# EAGLE design EarBones (EAGLE 7.6.0)
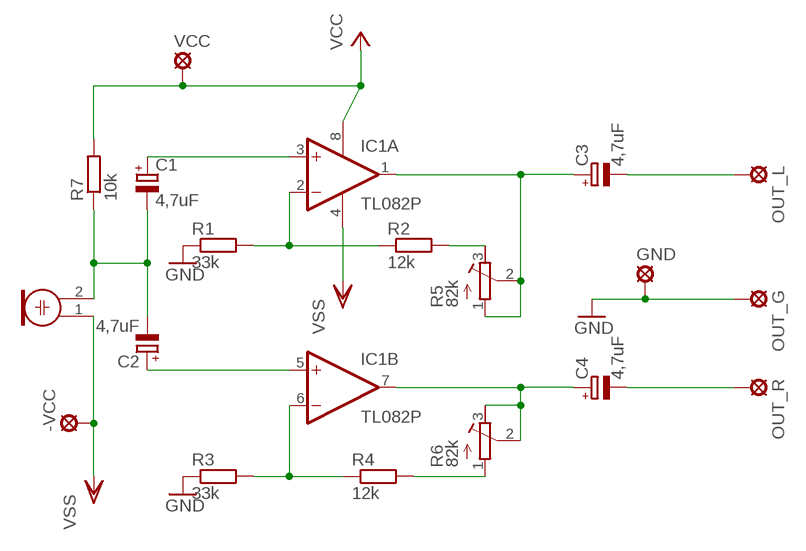
[diagram p0: schematic, sheet 1]

## Parts
-VCC  LSP10  [LSP10]
C1  4,7uF  CPOL-EUE2,5-6E  [E2,5-6E]
C2  4,7uF  CPOL-EUE2,5-6E  [E2,5-6E]
C3  4,7uF  CPOL-EUE2,5-6E  [E2,5-6E]
C4  4,7uF  CPOL-EUE2,5-6E  [E2,5-6E]
GND  LSP10  [LSP10]
IC1  TL082P  [DIL08]
M1  ELECTRET_MICROPHON-WM-61B  [WM-61B]
OUT_G  LSP10  [LSP10]
OUT_L  LSP10  [LSP10]
OUT_R  LSP10  [LSP10]
R1  33k  R-EU_0207/10  [0207/10]
R2  12k  R-EU_0207/10  [0207/10]
R3  33k  R-EU_0207/10  [0207/10]
R4  12k  R-EU_0207/10  [0207/10]
R5  82k  R-TRIMM3339P  [RTRIM3339P]
R6  82k  R-TRIMM3339P  [RTRIM3339P]
R7  10k  R-EU_0207/10  [0207/10]
VCC  LSP10  [LSP10]

## Nets
GND: GND.MP OUT_G.MP R1.1 R3.1
N$1: IC1.6(B:-IN) R3.2 R4.1
N$2: R4.2 R6.1(A)
N$3: C4.+ IC1.7(B:OUT) R6.2(S) R6.3(E)
N$4: C3.+ IC1.1(A:OUT) R5.1(A) R5.2(S)
N$5: R2.2 R5.3(E)
N$6: IC1.2(A:-IN) R1.2 R2.1
N$7: C1.+ IC1.3(A:+IN)
N$8: C2.+ IC1.5(B:+IN)
N$10: C1.- C2.- M1.2 R7.1
N$13: C4.- OUT_R.MP
N$14: C3.- OUT_L.MP
VCC: IC1.8(P:V+) R7.2 VCC.MP
VSS: -VCC.MP IC1.4(P:V-) M1.1

## Library data of the parts
-VCC GND OUT_G OUT_L OUT_R VCC = solpad:LSP10: SOLDER PAD drill 1.0 mm, distributor Buerklin, 12H555
C1-C4 = rcl:CPOL-EU: POLARIZED CAPACITOR, European symbol
IC1 = linear:TL082: OP AMP Data sheet <http://www.ti.com/lit/ds/symlink/tl084a . pdf>; DATA_SHEET: <a href="http://www.ti.com/lit/ds/symlink/tl084a.pdf"> Data sheet </a>
M1 = microphon:ELECTRET_MICROPHON-: Electret Condenser Microphone
R1-R4 R7 = rcl:R-EU_: RESISTOR, European symbol
R5 R6 = rcl:R-TRIMM: Trimm resistor

## Board
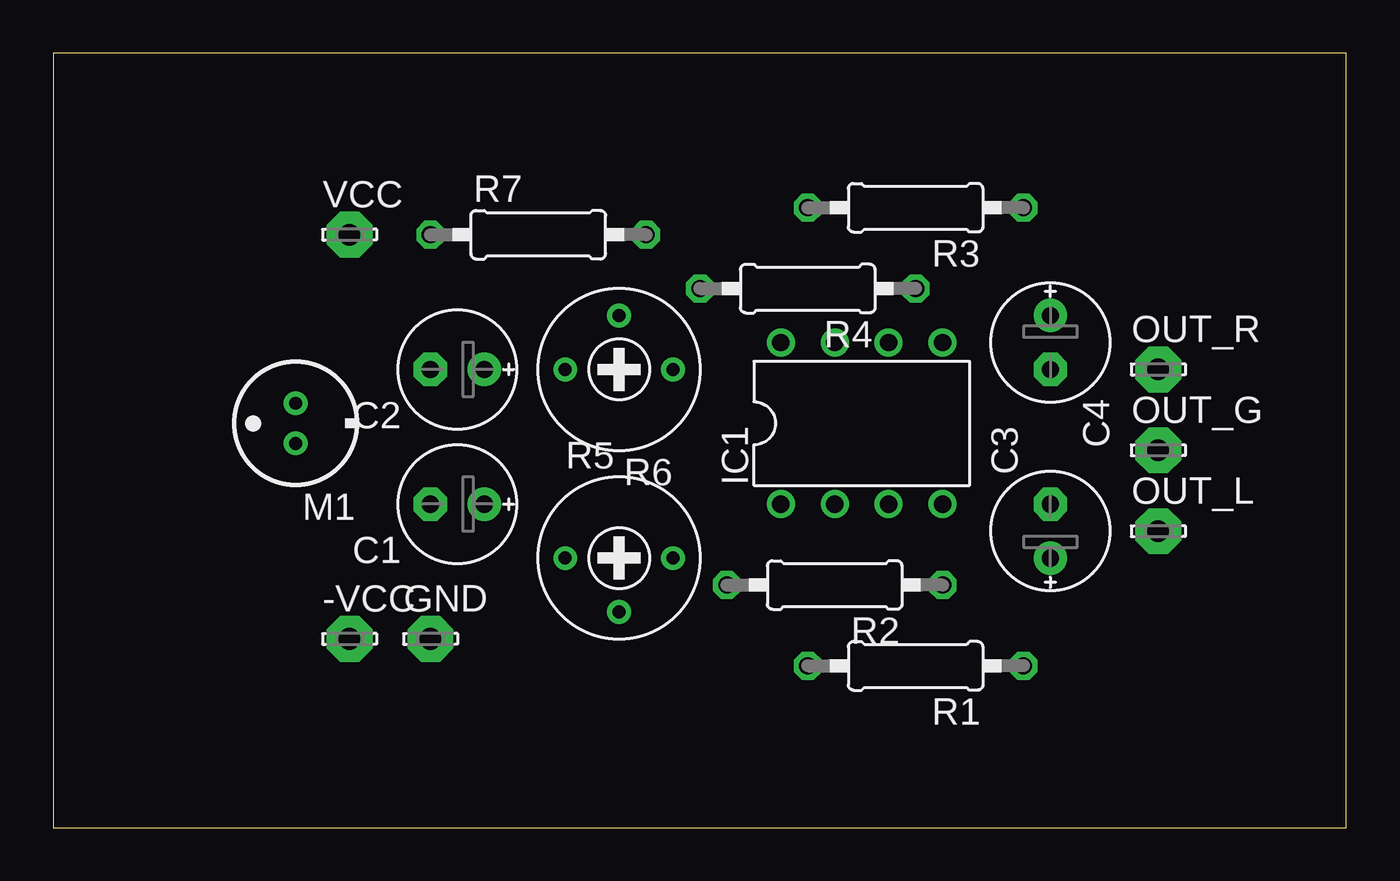
[diagram p1: board, top side]
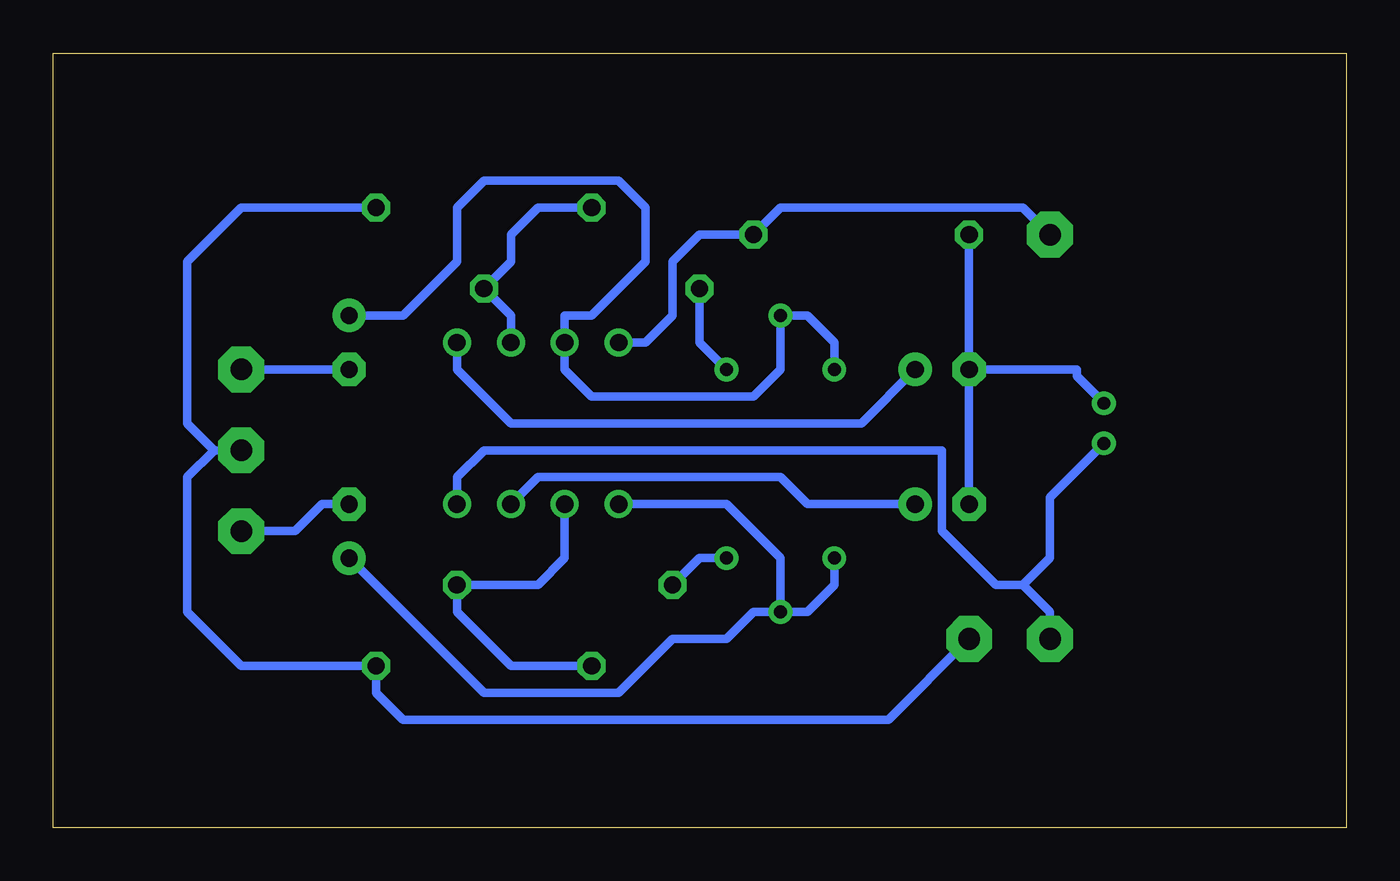
[diagram p2: board, bottom side, seen from below]

Size 60.94 x 36.5 mm. Coordinates in mm from the lower left corner, seen from the top.
Outline: 0,0 60.94,0 60.94,36.5 0,36.5 0,0
Copper layers (1*16): Top 0.035mm / dielectric 1.5mm / Bottom 0.035mm
Design rules "default": minimum track width 10mil, minimum drill 24mil, track to track 8mil, track to pad 8mil, pad to pad 8mil, via to via 8mil, smd to smd 8mil, copper to edge 40mil, drill to drill 8mil, minimum pad ring 10mil, minimum via ring 8mil, stop-mask expansion 4mil, vias tented up to drill 0mil, thermal gap 10mil

### Footprints (pad centres in the part's own frame; a part is rotated, then mirrored left to right if it is on the bottom)
LSP10 = drill 1.016 pad 2.159 octagon: MP 0,0
E2,5-6E = drill 0.813 pad 1.575: + -1.27,0 | drill 0.813 pad 1.575 octagon: - 1.27,0
DIL08 = drill 0.813 pad 1.27: 1 -3.81,-3.81; 2 -1.27,-3.81; 3 1.27,-3.81; 4 3.81,-3.81; 5 3.81,3.81; 6 1.27,3.81; 7 -1.27,3.81; 8 -3.81,3.81
WM-61B = drill 0.6 pad 1: 1 0,0.95; 2 0,-0.95
0207/10 = drill 0.813 octagon: 1 -5.08,0; 2 5.08,0
RTRIM3339P = drill 0.61: 1 -2.54,0; 2 0,-2.54; 3 2.54,0

### Placement (x,y rotation side)
-VCC  13.97,8.89 0 top
C1  19.05,15.24 180 top
C2  19.05,21.59 180 top
C3  46.99,13.97 90 top
C4  46.99,22.86 270 top
GND  17.78,8.89 0 top
IC1  38.1,19.05 0 top
M1  11.43,19.05 180 top
OUT_G  52.07,17.78 0 top
OUT_L  52.07,13.97 0 top
OUT_R  52.07,21.59 0 top
R1  40.64,7.62 180 top
R2  36.83,11.43 180 top
R3  40.64,29.21 180 top
R4  35.56,25.4 180 top
R5  26.67,12.7 0 top
R6  26.67,21.59 180 top
R7  22.86,27.94 0 top
VCC  13.97,27.94 0 top

### Tracks (layer width: path | path; a pad name or v marks a point on that pad's centre or on a via)
GND
  Bottom 0.406: OUT_G.MP 53.34,17.78 | 53.34,17.78 54.61,19.05 54.61,26.67 52.07,29.21 R3.1 | 53.34,17.78 54.61,16.51 54.61,10.16 52.07,7.62 R1.1 45.72,6.35 44.45,5.08 21.59,5.08 GND.MP
N$1
  Bottom 0.406: R3.2 38.1,29.21 39.37,27.94 39.37,26.67 R4.1 39.37,24.13 IC1.6
N$2
  Bottom 0.406: R6.1 30.48,22.86 R4.2
N$3
  Bottom 0.406: R6.3 24.13,22.86 25.4,24.13 R6.2 26.67,21.59 27.94,20.32 35.56,20.32 36.83,21.59 IC1.7 36.83,24.13 35.56,24.13 33.02,26.67 33.02,29.21 34.29,30.48 40.64,30.48 41.91,29.21 41.91,26.67 44.45,24.13 C4.+
N$4
  Bottom 0.406: R5.1 24.13,11.43 25.4,10.16 R5.2 | R5.2 26.67,12.7 29.21,15.24 IC1.1 | C3.+ 40.64,6.35 34.29,6.35 31.75,8.89 29.21,8.89 27.94,10.16 R5.2
N$5
  Bottom 0.406: R5.3 30.48,12.7 R2.2
N$6
  Bottom 0.406: R1.2 39.37,7.62 41.91,10.16 R2.1 38.1,11.43 36.83,12.7 IC1.2
N$7
  Bottom 0.406: IC1.3 38.1,16.51 26.67,16.51 25.4,15.24 C1.+
N$8
  Bottom 0.406: C2.+ 22.86,19.05 39.37,19.05 41.91,21.59 IC1.5
N$10
  Bottom 0.406: M1.2 12.7,21.27 12.7,21.59 C2.- | C1.- C2.- | C2.- R7.1
N$13
  Bottom 0.406: C4.- OUT_R.MP
N$14
  Bottom 0.406: C3.- 48.26,15.24 49.53,13.97 OUT_L.MP
VCC
  Bottom 0.406: VCC.MP 15.24,29.21 26.67,29.21 R7.2 30.48,27.94 31.75,26.67 31.75,24.13 33.02,22.86 IC1.8
VSS
  Bottom 0.406: IC1.4 41.91,16.51 40.64,17.78 19.05,17.78 19.05,13.97 16.51,11.43 15.24,11.43 | 15.24,11.43 13.97,10.16 -VCC.MP | M1.1 13.97,15.56 13.97,12.7 15.24,11.43